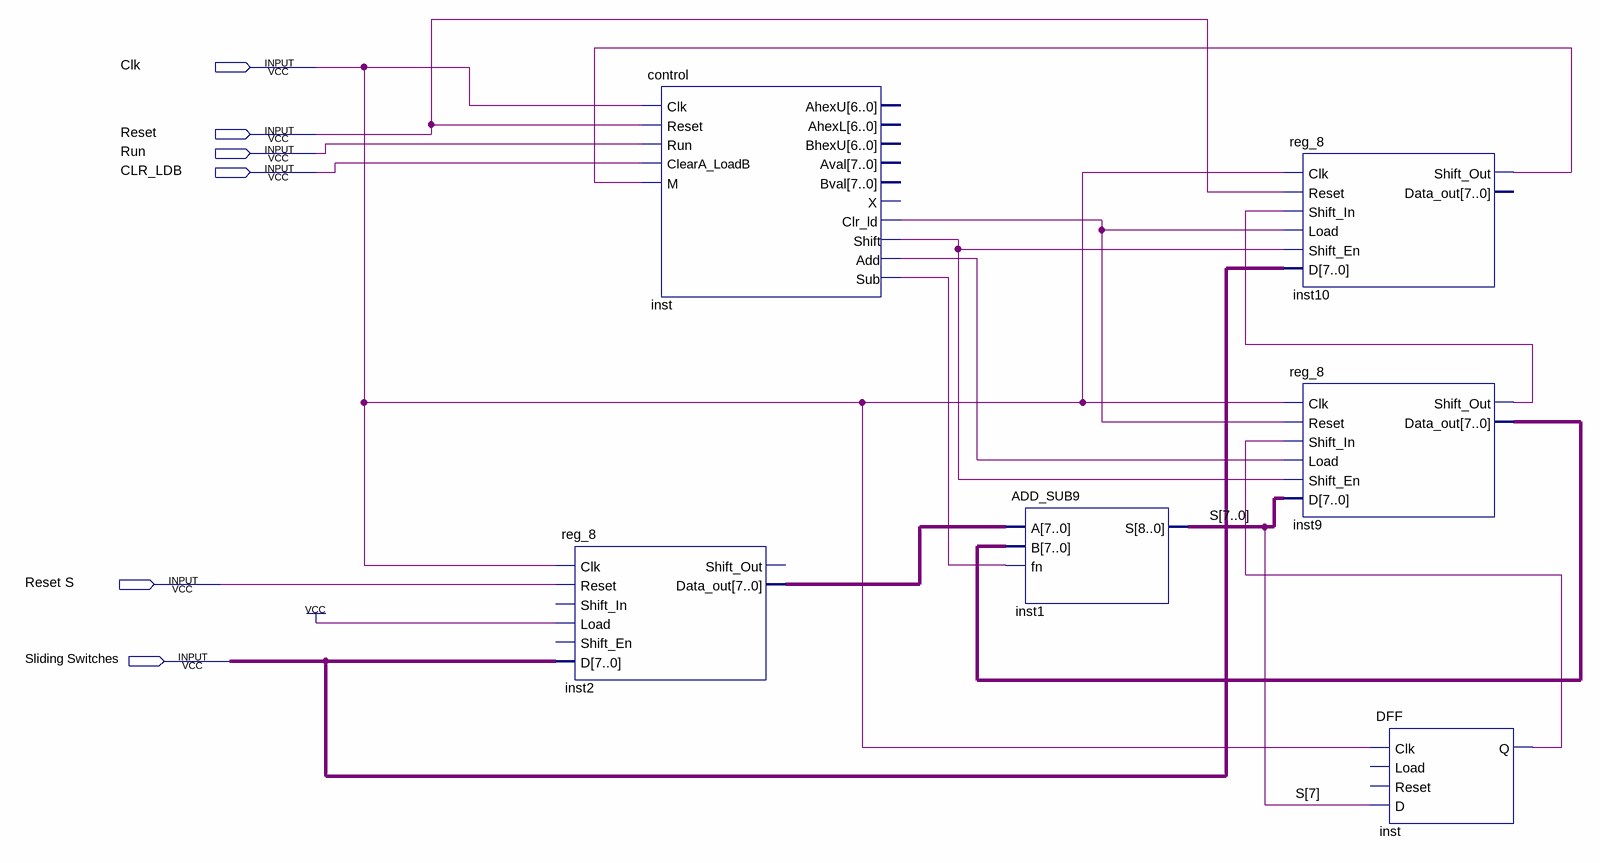
[diagram p0: schematic sheet]
// Quartus schematic 8bitmult.bdf as structural Verilog: 6 symbols, 6 pins
module \8bitmult  (
  input  Clk,
  input  Reset,
  input  Run,
  input  CLR_LDB,
  input  \Reset_S ,
  input  \Sliding_Switches 
);

  wire inst9_shift_out, inst10_shift_out, inst_add, inst_clr_ld, inst_q, inst_shift, inst_sub;
  wire [7:0] inst2_data_out, inst9_data_out, S, undriven;

  reg_8 inst2 (
    .Clk(Clk), .Reset(\Reset_S ), .Load(1'b1), .D(undriven), .Data_out(inst2_data_out));  // open: Shift_In, Shift_En, Shift_Out
  control inst (
    .Clk(Clk), .Reset(Reset), .Run(Run), .ClearA_LoadB(CLR_LDB), .M(inst10_shift_out), .Clr_ld(inst_clr_ld),
    .Shift(inst_shift), .Add(inst_add), .Sub(inst_sub));  // open: AhexU, AhexL, BhexU, Aval, Bval, X
  ADD_SUB9 inst1 (.A(inst2_data_out), .B(inst9_data_out), .fn(inst_sub), .S(S));
  reg_8 inst10 (
    .Clk(Clk), .Reset(Reset), .Shift_In(inst9_shift_out), .Load(inst_clr_ld), .Shift_En(inst_shift),
    .D(undriven), .Shift_Out(inst10_shift_out));  // open: Data_out
  reg_8 inst9 (
    .Clk(Clk), .Reset(inst_clr_ld), .Shift_In(inst_q), .Load(inst_add), .Shift_En(inst_shift), .D(S),
    .Shift_Out(inst9_shift_out), .Data_out(inst9_data_out));
  DFF inst_dup2 (.Clk(Clk), .D(S[7]), .Q(inst_q));  // open: Load, Reset
endmodule
